# Altium schematic sheet Interface - RS485.SchDoc: [16] Interface - RS485
size A4; ApprovedBy: Nagy Richard; CheckedBy: Nagy Richard; Author: Nagy Richard; CompanyName: EmbedCore; DrawnBy: Nagy Richard; Engineer: Nagy Richard; DocumentNumber: 16; Revision: 1.0; SheetNumber: 15; SheetTotal: 25
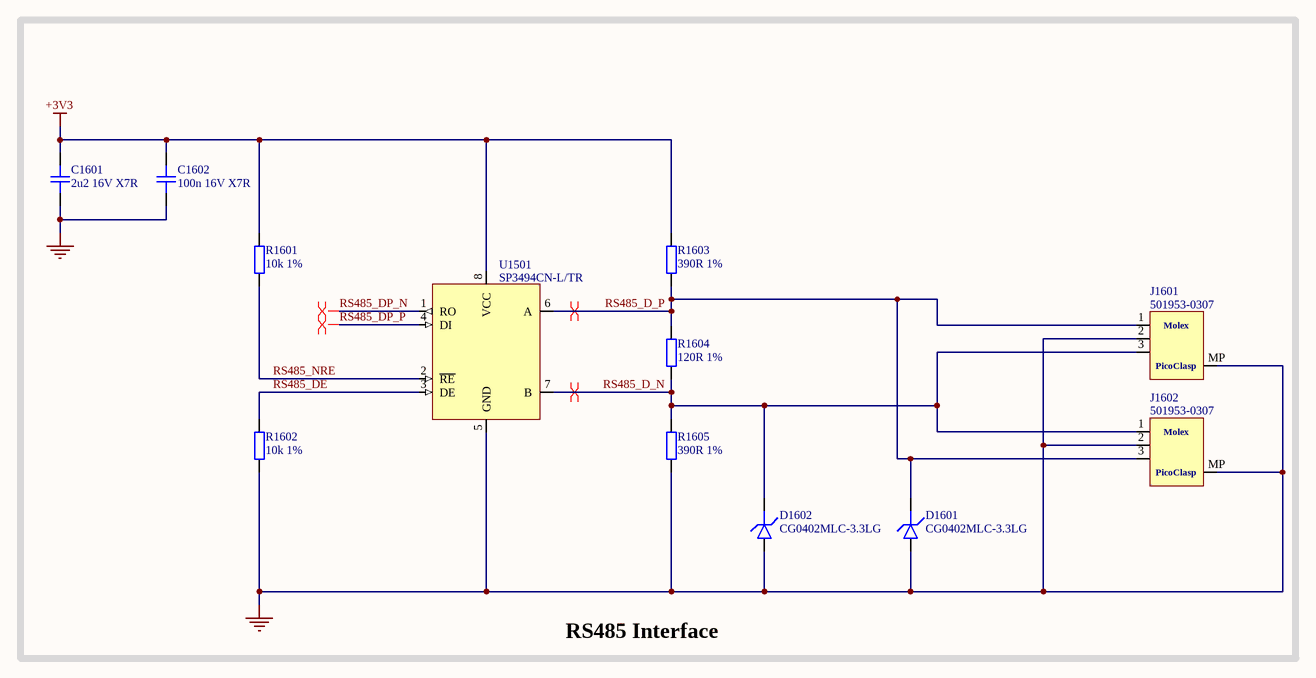
[diagram p0: Interface - RS485.SchDoc]

## Parts
C1601  2u2 16V X7R  [CAP_0603]
C1602  100n 16V X7R  [CAP_0402]
D1601  CG0402MLC-3.3LG  [D_0402]
D1602  CG0402MLC-3.3LG  [D_0402]
J1601  501953-0307  [5019530307]
J1602  501953-0307  [5019530307]
R1601  10k 1%  [RES_0402]
R1602  10k 1%  [RES_0402]
R1603  390R 1%  [RES_0402]
R1604  120R 1%  [RES_0402]
R1605  390R 1%  [RES_0402]
U1501  SP3494CN-L/TR  [SOIC-8]

## Blocks framed on the sheet
RS485 Interface: C1601 C1602 D1601 D1602 J1601 J1602 R1601-R1605 U1501

## Nets
+3V3: C1601.2 C1602.2 R1601.2 R1603.2 U1501.8(VCC)
GND: C1601.1 C1602.1 D1601.A D1602.A J1601.2 J1601.MP J1602.2 J1602.MP R1602.1 R1605.1 U1501.5(GND)
RS485_D_N: D1602.K J1601.3 J1602.1 R1604.1 R1605.2 U1501.7(B)
RS485_D_P: D1601.K J1601.1 J1602.3 R1603.1 R1604.2 U1501.6(A)
RS485_DE: R1602.2 U1501.3(DE)
RS485_DP_N: U1501.1(RO)
RS485_DP_P: U1501.4(DI)
RS485_NRE: R1601.1 U1501.2(~{RE})

## Layout directives
differential pair: RS485_D_N, RS485_D_P, RS485_DP_N, RS485_DP_P

## Notes on the sheet
- Title:
- Drawn By:
- Page Contents:
- Checked By:
- Size:
- Date:
- File:
- License:
- Email:
- A4
- Number:
- Time:
- Revision:
- Sheet
- Website:
- of
- (in symbol 501953-0307) Molex; PicoClasp

## Library data of the parts
C1601 = CAP_0603: Capacitor SMD 0603; Manufacturer: YAGEO; Manufacturer Part Number: CC0603KRX7R7BB225; Distributor Link: www.lcsc.com; LCSC: C914769; Rating: *; Dielectric: *
C1602 = CAP_0402: Capacitor SMD 0402; Manufacturer: YAGEO; Manufacturer Part Number: CC0402JRX7R7BB104; Distributor Link: www.lcsc.com; LCSC: C541464; Rating: *; Dielectric: *
D1601 D1602 = D_TVS_0402: Diode TVS / ESD 0402
J1601 J1602 = 501953-0307: Headers & Wire Housings 1.0WtBWaferAssyR/A1- -Row3Ckt+LKEmbsTpPkg
R1601 R1602 = RES_0402: Resistor SMD 0402; Manufacturer: PANASONIC; Manufacturer Part Number: ERJPA2F1002X; Distributor Link: www.lcsc.com; LCSC: C427247
R1603 R1605 = RES_0402: Resistor SMD 0402; Manufacturer: PANASONIC; Manufacturer Part Number: ERJ2GEJ391X; Distributor Link: www.lcsc.com; LCSC: C412983
R1604 = RES_0402: Resistor SMD 0402; Manufacturer: PANASONIC; Manufacturer Part Number: ERJ2GEJ121X; Distributor Link: www.lcsc.com; LCSC: C412974
U1501 = SP3494CN-L/TR: 3.3V Low Power RS-485 / RS-422 Transceiver SOIC-8; Manufacturer: MaxLinear; Manufacturer Part Number: SP3494CN-L/TR